# EAGLE design stm32f4 (EAGLE 5.11)
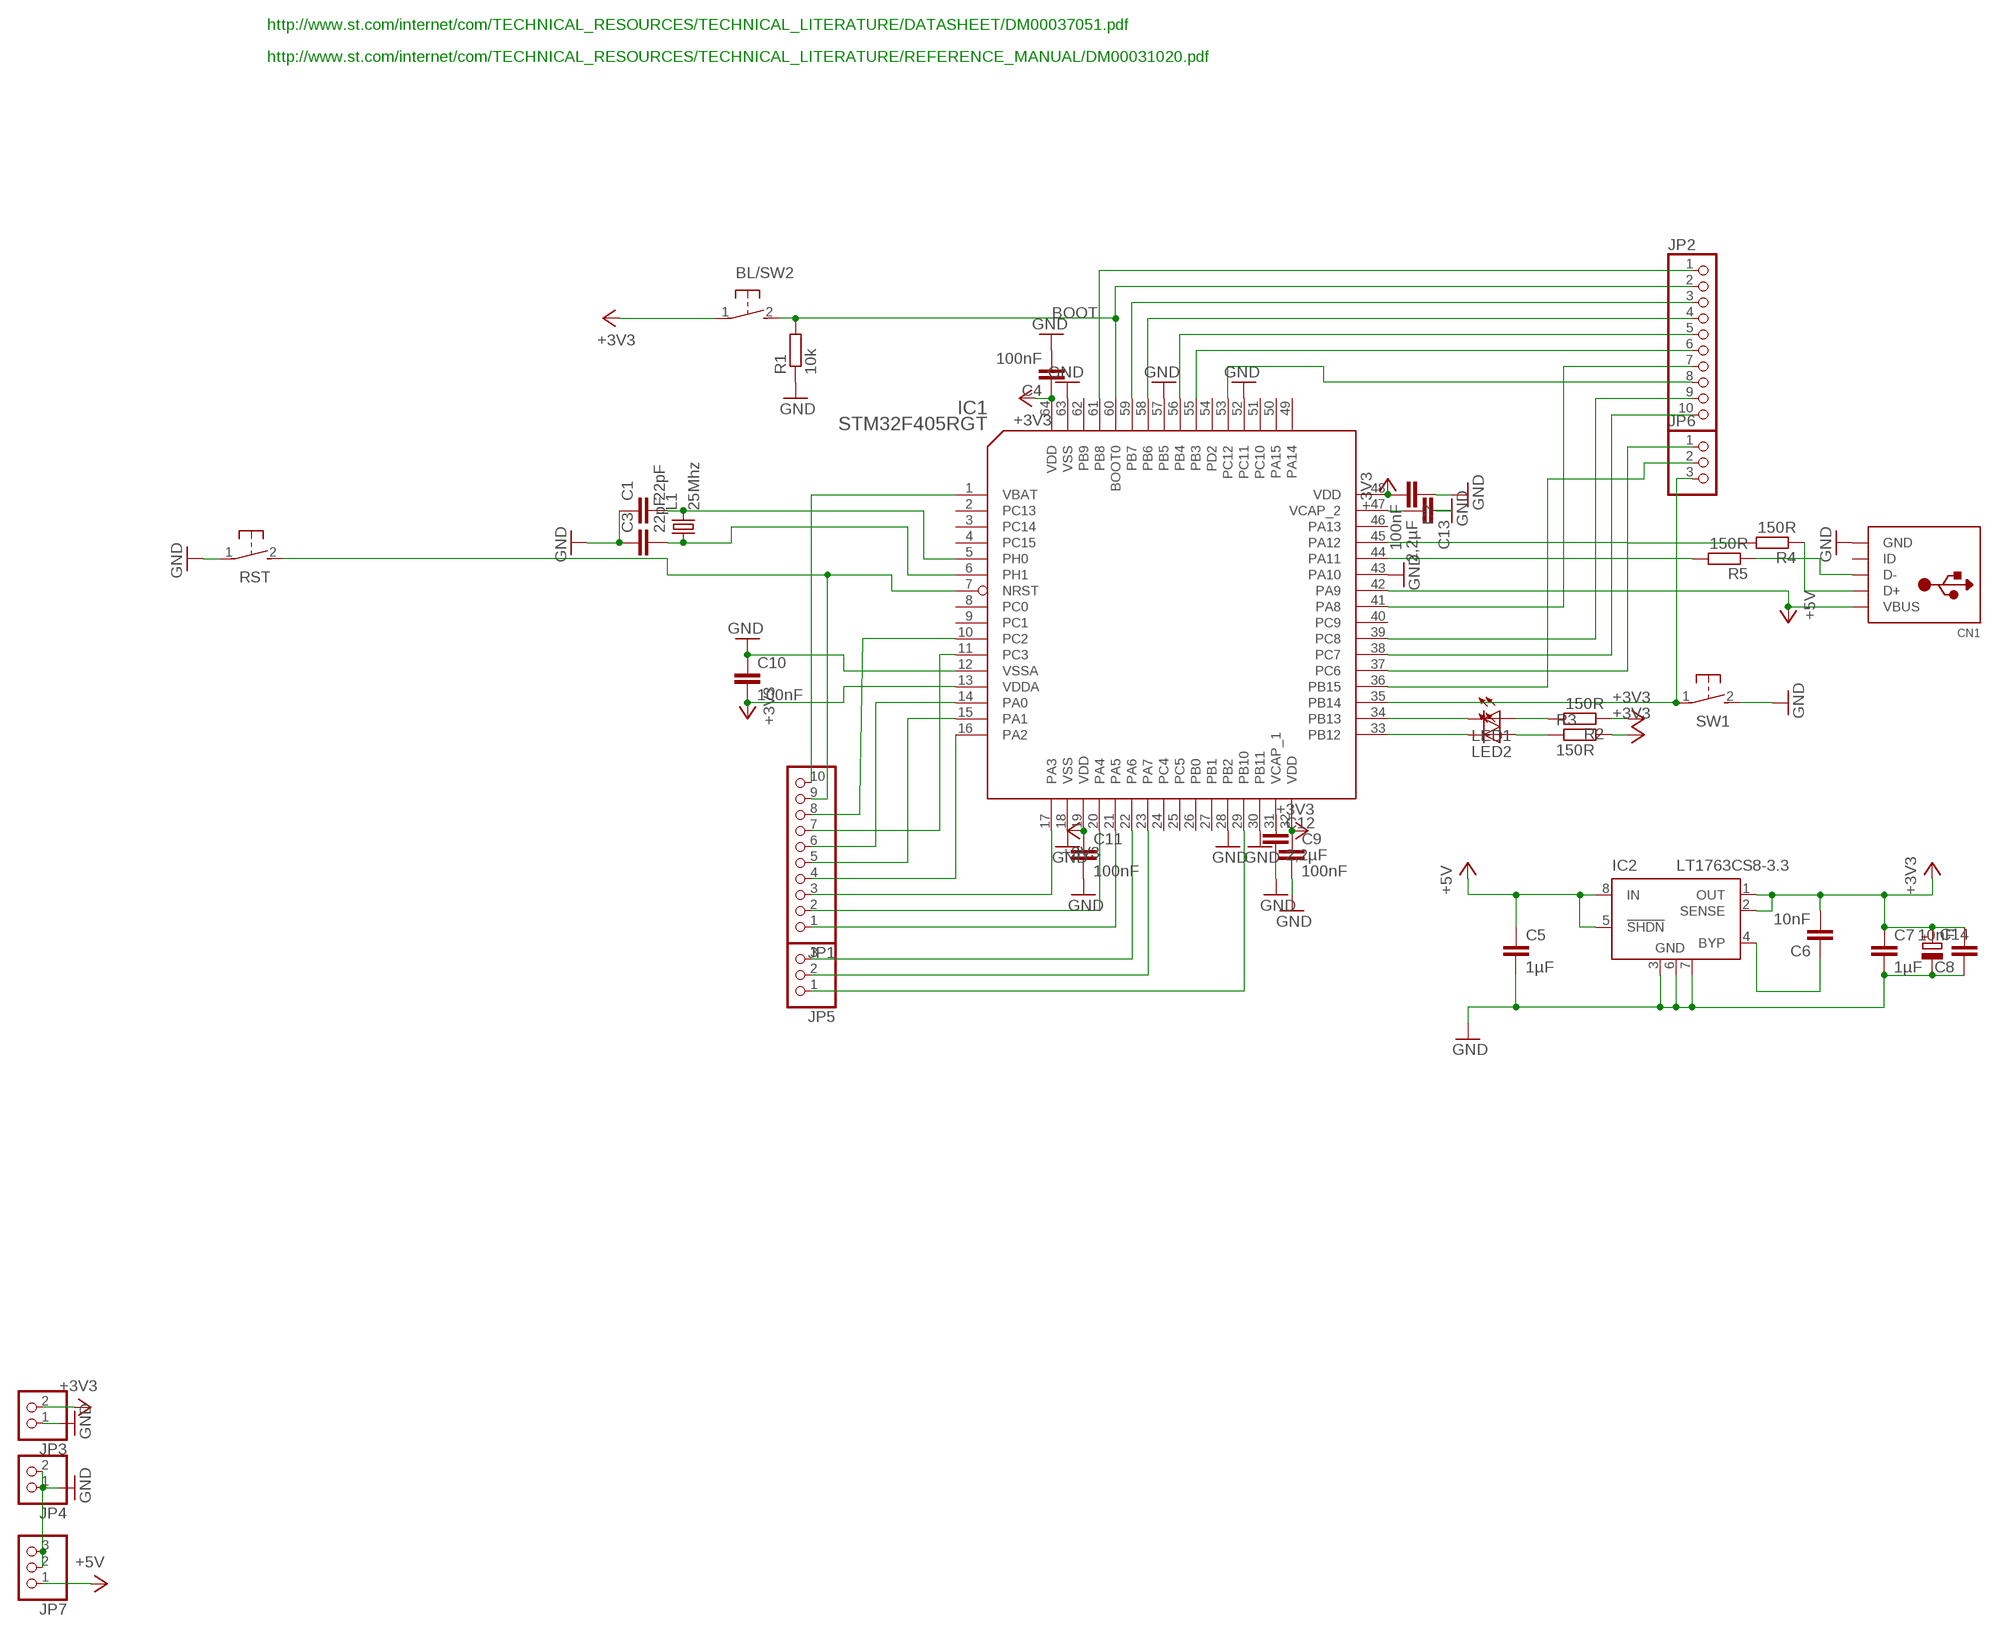
[diagram p0: schematic, sheet 1]

## Parts
BL/SW2  SWITCH_MCTAEF  [SWITCH_MCTAEF]
C1  22pF  C-EUC0402  [C0402]
C2  100nF  C-EUC0402  [C0402]
C3  22pF  C-EUC0402  [C0402]
C4  100nF  C-EUC0402  [C0402]
C5  1µF  CAP0805  [0805]
C6  10nF  C-EUC0402  [C0402]
C7  1µF  CAP0805  [0805]
C8  10nF  C-EUC0402  [C0402]
C9  100nF  C-EUC0402  [C0402]
C10  100nF  C-EUC0402  [C0402]
C11  100nF  C-EUC0402  [C0402]
C12  2,2µF  CAP0805  [0805]
C13  2,2µF  CAP0805  [0805]
C14  CPOL-EUSMCA  [SMC_A]
CN1  USBMINIB  [USB-MINIB]
IC1  STM32F405RGT  [LQFP64]
IC2  LT1763CS8-3.3  [SOIC8]
JP1  PINHD-1X10_2.54  [1X10]
JP2  PINHD-1X10_2.54  [1X10]
JP3  PINHD-1X02_2.54  [1X02]
JP4  PINHD-1X02_2.54  [1X02]
JP5  PINHD-1X03_2.54  [1X03]
JP6  PINHD-1X03_2.54  [1X03]
JP7  PINHD-1X03_2.54  [1X03]
L1  25Mhz  X22-OSCILLATOR  [X22]
LED1  LEDCHIPLED_0805  [CHIPLED_0805]
LED2  LEDCHIPLED_0805  [CHIPLED_0805]
R1  10k  R-EU_R0402  [R0402]
R2  150R  R-EU_R0402  [R0402]
R3  150R  R-EU_R0402  [R0402]
R4  150R  R-EU_R0402  [R0402]
R5  150R  R-EU_R0402  [R0402]
RST  SWITCH_MCTAEF  [SWITCH_MCTAEF]
SW1  SWITCH_MCTAEF  [SWITCH_MCTAEF]

## Nets
+3V3: BL/SW2.1 C2.2 C4.1 C6.2 C7.1 C8.2 C9.1 C10.2 C11.1 C14.+ IC1.13(VDDA) IC1.19(VDD) IC1.32(VDD) IC1.48(VDD) IC1.64(VDD) IC2.1(OUT) IC2.2(SENSE) JP3.2 R2.1 R3.2
+5V: C5.1 CN1.VBUS IC1.42(PA9) IC2.5(!SHDN) IC2.8(IN) JP7.1
A0: IC1.14(PA0) JP1.6
A1: IC1.15(PA1) JP1.5
A3: IC1.17(PA3) JP1.3
A4: IC1.20(PA4) JP1.2
A5: IC1.21(PA5) JP1.1
A6: IC1.22(PA6) JP5.3
A7: IC1.23(PA7) JP5.2
A8: IC1.41(PA8) JP2.7
B4: IC1.56(PB4) JP2.5
B6: IC1.58(PB6) JP2.4
B7: IC1.59(PB7) JP2.3
B8: IC1.61(PB8) JP2.1
B10: IC1.29(PB10) JP5.1
B14: IC1.35(PB14) JP6.3 SW1.1
B15: IC1.36(PB15) JP6.2
BOOT: BL/SW2.2 IC1.60(BOOT0) JP2.2 R1.2
C2: IC1.10(PC2) JP1.8
C3: IC1.11(PC3) JP1.7
C6: IC1.37(PC6) JP6.1
C7: IC1.38(PC7) JP2.10
C8: IC1.39(PC8) JP2.9
C12: IC1.53(PC12) JP2.8
GND: C1.1 C2.1 C3.1 C4.2 C5.2 C7.2 C8.1 C9.2 C10.1 C11.2 C12.2 C13.1 C14.- CN1.GND IC1.12(VSSA) IC1.18(VSS) IC1.28(PB2) IC1.30(PB11) IC1.43(PA10) IC1.52(PC11) IC1.57(PB5) IC1.63(VSS) IC2.3(GND) IC2.6(GND) IC2.7(GND) JP3.1 JP4.1 JP4.2 JP7.2 JP7.3 R1.1 RST.1 SW1.2
N$2: IC1.16(PA2) JP1.4
N$3: C3.2 IC1.6(PH1) L1.1
N$4: C1.2 IC1.5(PH0) L1.3
N$5: IC1.7(NRST) JP1.9 RST.2
N$10: IC1.44(PA11) R5.2
N$12: C12.1 IC1.31(VCAP_1)
N$13: C6.1 IC2.4(BYP)
N$14: C13.2 IC1.47(VCAP_2)
N$15: IC1.33(PB12) LED2.C
N$18: LED1.A R2.2
N$22: LED2.A R3.1
N$26: IC1.34(PB13) LED1.C
N$32: IC1.45(PA12) R4.2
N$39: CN1.D+ R4.1
N$40: CN1.D- R5.1
PB3: IC1.55(PB3) JP2.6
VBAT: IC1.1(VBAT) JP1.10
Unconnected: CN1.ID IC1.2(PC13) IC1.3(PC14) IC1.4(PC15) IC1.8(PC0) IC1.9(PC1) IC1.24(PC4) IC1.25(PC5) IC1.26(PB0) IC1.27(PB1) IC1.40(PC9) IC1.46(PA13) IC1.49(PA14) IC1.50(PA15) IC1.51(PC10) IC1.54(PD2) IC1.62(PB9)

## Notes on the sheet
- http://www.st.com/internet/com/TECHNICAL_RESOURCES/TECHNICAL_LITERATURE/DATASHEET/DM00037051.pdf
- http://www.st.com/internet/com/TECHNICAL_RESOURCES/TECHNICAL_LITERATURE/REFERENCE_MANUAL/DM00031020.pdf

## Library data of the parts
BL/SW2 RST SW1 = seb:SWITCH_MCTAEF
C1-C4 C6 C8-C11 = rcl:C-EU: CAPACITOR, European symbol
C5 C7 C12 C13 = SparkFun:CAP: Capacitor Standard 0603 ceramic capacitor, and 0.1" leaded capacitor.
C14 = rcl:CPOL-EU: POLARIZED CAPACITOR, European symbol
CN1 = microbuilder:USB: USB Connectors USBMINIB - Surface Mount Female Mini-B USB Connector 4UConnector: 06564
IC1 = stm32:STM32F405R*T: STM32F405R*T ARM Cortex-M4 32b MCU+FPU, 210DMIPS, up to 1MB Flash/192+4KB RAM, USB OTG HS/FS, 17 TIMs, 3 ADCs, 15 comm.
IC2 = linear-technology:LT1763CS8: 500mA, Low Noise, LDO Micropower Regulators Source: http://cds.linear.com/docs/Datasheet/1763ff.pdf; MPN: LT1763CS8-3.3; OC_FARNELL: 1273617; OC_NEWARK: 57M6055
JP1 JP2 = pinhead-2:PINHD-1X10: PIN HEADER
JP3 JP4 = pinhead-2:PINHD-1X02: PIN HEADER
JP5-JP7 = pinhead-2:PINHD-1X03: PIN HEADER
L1 = seb:X22-OSCILLATOR
LED1 LED2 = led:LED: LED OSRAM: - CHIPLED LG R971, LG N971, LY N971, LG Q971, LY Q971, LO R971, LY R971 LH N974, LH R974 LS Q976, LO Q976, LY Q976 LO Q996 - Hyper CHIPLED LW Q18S LB Q993, LB Q99A, LB R99A - SideLED LS A670, LO A670, LY A670, LG A670, LP A670 LB A673, LV A673, LT A673, LW A673 LH A674 LY A675 LS A676, LA A676, LO A676, LY A676, LW A676 LS A679, LY A679, LG A679 - Hyper Micro SIDELED® LS Y876, LA Y876, LO Y876, LY Y876 LT Y87S - SmartLED LW L88C, LW L88S LB L89C, LB L89S, LG L890 LS L89K, LO L89K, LY L89K LS L896, LA L896, LO L896, LY L896 - TOPLED LS T670, LO T670, LY T670, LG T670, LP T670 LSG T670, LSP T670, LSY T670, LOP T670, LYG T670 LG T671, LOG T671, LSG T671 LB T673, LV T673, LT T673, LW T673 LH T674 LS T676, LA T676, LO T676, LY T676, LB T676, LH T676, LSB T676, LW T676 LB T67C, LV T67C, LT T67C, LS T67K, LO T67K, LY T67K, LW E67C LS E67B, LA E67B, LO E67B, LY E67B, LB E67C, LV E67C, LT E67C LW T67C LS T679, LY T679, LG T679 LS T770, LO T770, LY T770, LG T770, LP T770 LB T773, LV T773, LT T773, LW T773 LH T774 LS E675, LA E675, LY E675, LS T675 LS T776, LA T776, LO T776, LY T776, LB T776 LHGB T686 LT T68C, LB T68C - Hyper Mini TOPLED® LB M676 - Mini TOPLED Santana® LG M470 LS M47K, LO M47K, LY M47K Source: http://www.osram.convergy.de LUXEON: - LUMILED® LXK2-PW12-R00, LXK2-PW12-S00, LXK2-PW14-U00, LXK2-PW14-V00 LXK2-PM12-R00, LXK2-PM12-S00, LXK2-PM14-U00 LXK2-PE12-Q00, LXK2-PE12-R00, LXK2-PE12-S00, LXK2-PE14-T00, LXK2-PE14-U00 LXK2-PB12-K00, LXK2-PB12-L00, LXK2-PB12-M00, LXK2-PB14-N00, LXK2-PB14-P00, LXK2-PB14-Q00 LXK2-PR12-L00, LXK2-PR12-M00, LXK2-PR14-Q00, LXK2-PR14-R00 LXK2-PD12-Q00, LXK2-PD12-R00, LXK2-PD12-S00 LXK2-PH12-R00, LXK2-PH12-S00 LXK2-PL12-P00, LXK2-PL12-Q00, LXK2-PL12-R00 Source: www.luxeon.com KINGBRIGHT: KA-3528ASYC Source: www.kingbright.com
R1-R5 = rcl:R-EU_: RESISTOR, European symbol

## Board
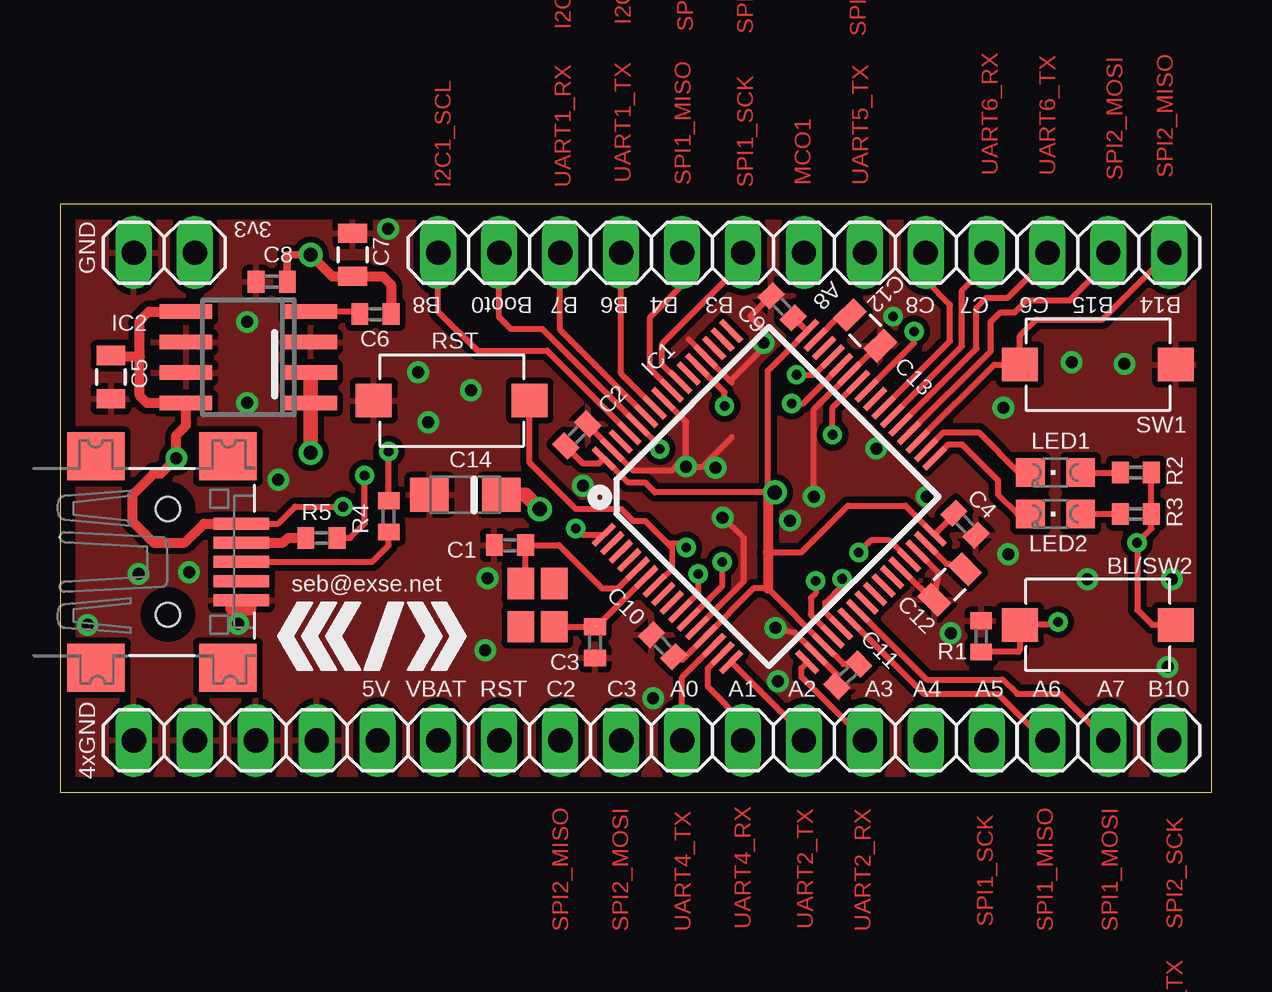
[diagram p1: board, top side]
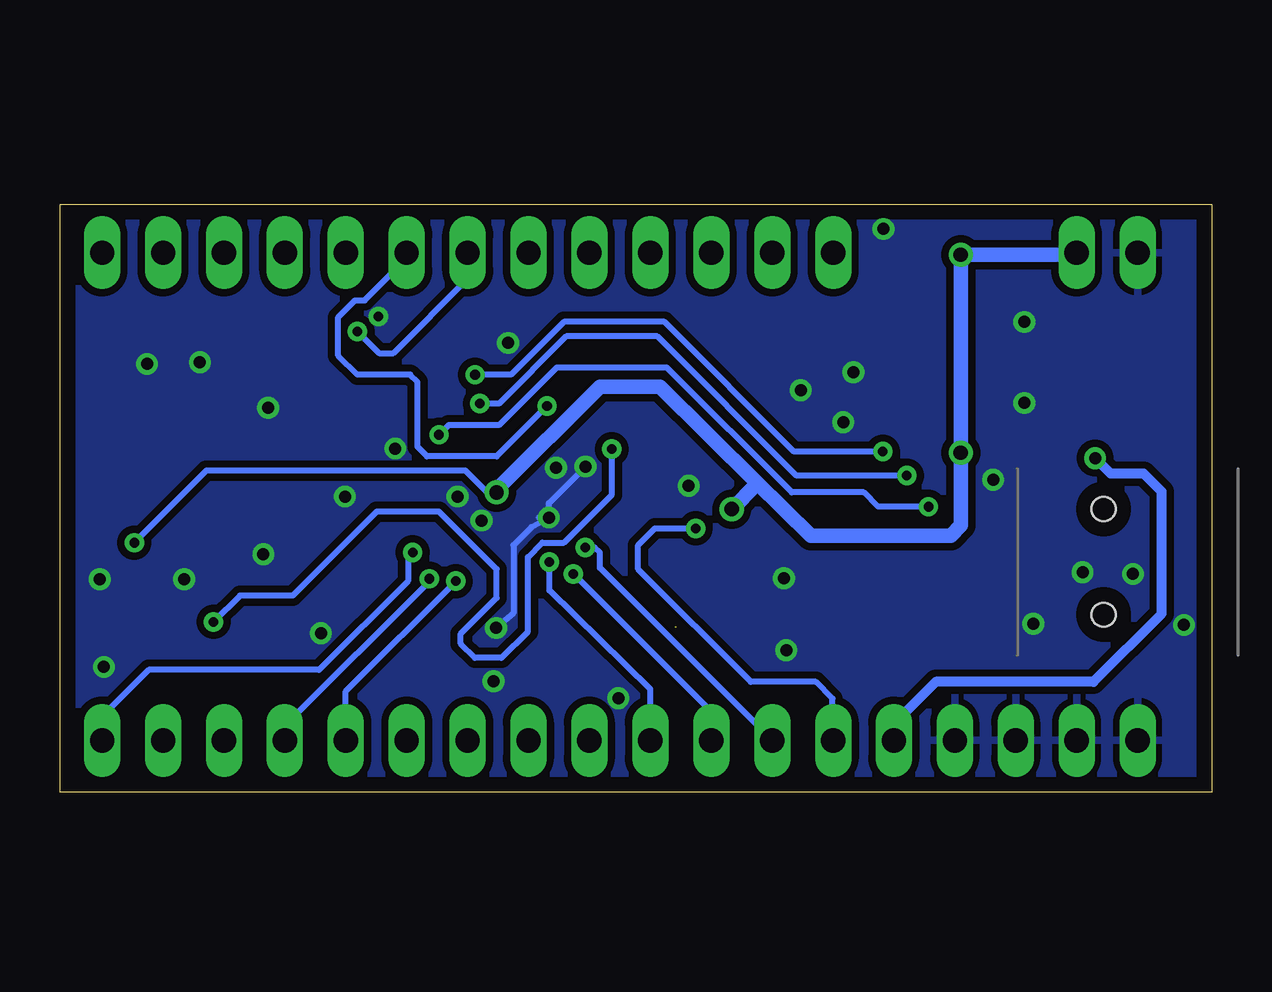
[diagram p2: board, bottom side, seen from below]

Size 48 x 24.5 mm. Coordinates in mm from the lower left corner, seen from the top.
Outline: 0,0 48,0 48,24.5 0,24.5 0,0
Copper layers (1*16): Top 0.035mm / dielectric 1.5mm / Bottom 0.035mm
Design rules "default *": minimum track width 9mil, minimum drill 0.4mm, track to track 8mil, track to pad 8mil, pad to pad 8mil, via to via 8mil, smd to smd 8mil, copper to edge 25mil, drill to drill 8mil, minimum pad ring 10mil, minimum via ring 8mil, stop-mask expansion 4mil, vias tented up to drill 40mil, thermal gap 10mil

### Footprints (pad centres in the part's own frame; a part is rotated, then mirrored left to right if it is on the bottom)
SWITCH_MCTAEF = smd 1.5 x 1.4: 1 -3.25,0; 2 3.25,0
C0402 = smd 0.7 x 0.9: 1 -0.65,0; 2 0.65,0
0805 = smd 0.8 x 1.2: 1 -0.9,0; 2 0.9,0
SMC_A = smd 1.6 x 1.4: + -1.5,0; - 1.5,0
USB-MINIB = smd 0.5 x 2.308: D+ 0,4.064; D- -0.8,4.064; GND 1.6,4.064; ID 0.8,4.064; VBUS -1.6,4.064 | smd 2 x 2.4: GND1 -4.4,-2; GND2 -4.4,3.5; GND3 4.4,3.5; GND4 4.4,-2 | hole 1: -2.2,1; 2.2,1
LQFP64 = smd 0.24 x 1.2: 1 -3.75,-6; 2 -3.25,-6; 3 -2.75,-6; 4 -2.25,-6; 5 -1.75,-6; 6 -1.25,-6; 7 -0.75,-6; 8 -0.25,-6; 9 0.25,-6; 10 0.75,-6; 11 1.25,-6; 12 1.75,-6; 13 2.25,-6; 14 2.75,-6; 15 3.25,-6; 16 3.75,-6; 33 3.75,6; 34 3.25,6; 35 2.75,6; 36 2.25,6; 37 1.75,6; 38 1.25,6; 39 0.75,6; 40 0.25,6; 41 -0.25,6; 42 -0.75,6; 43 -1.25,6; 44 -1.75,6; 45 -2.25,6; 46 -2.75,6; 47 -3.25,6; 48 -3.75,6 | smd 1.2 x 0.24: 17 6,-3.75; 18 6,-3.25; 19 6,-2.75; 20 6,-2.25; 21 6,-1.75; 22 6,-1.25; 23 6,-0.75; 24 6,-0.25; 25 6,0.25; 26 6,0.75; 27 6,1.25; 28 6,1.75; 29 6,2.25; 30 6,2.75; 31 6,3.25; 32 6,3.75; 49 -6,3.75; 50 -6,3.25; 51 -6,2.75; 52 -6,2.25; 53 -6,1.75; 54 -6,1.25; 55 -6,0.75; 56 -6,0.25; 57 -6,-0.25; 58 -6,-0.75; 59 -6,-1.25; 60 -6,-1.75; 61 -6,-2.25; 62 -6,-2.75; 63 -6,-3.25; 64 -6,-3.75
SOIC8 = smd 0.6 x 2.2: 1 -1.905,-2.6; 2 -0.635,-2.6; 3 0.635,-2.6; 4 1.905,-2.6; 5 1.905,2.6; 6 0.635,2.6; 7 -0.635,2.6; 8 -1.905,2.6
1X10 = drill 1.016 long: 1 -11.43,0; 2 -8.89,0; 3 -6.35,0; 4 -3.81,0; 5 -1.27,0; 6 1.27,0; 7 3.81,0; 8 6.35,0; 9 8.89,0; 10 11.43,0
1X02 = drill 1.016 long: 1 -1.27,0; 2 1.27,0
1X03 = drill 1.016 long: 1 -2.54,0; 2 0,0; 3 2.54,0
X22 = smd 1.3 x 1.1: 1 0.9,0.7; 2 -0.9,0.7; 3 -0.9,-0.7; 4 0.9,-0.7
CHIPLED_0805 = smd 1.2 x 1.2: A 0,-1.05; C 0,1.05
R0402 = smd 0.7 x 0.9: 1 -0.65,0; 2 0.65,0

### Placement (x,y rotation side)
BL/SW2  43.27,6.97 180 top
C1  18.75,10.3 0 top
C2  21.54,14.89 225 top
C3  22.3,6.25 90 top
C4  37.73,11.17 315 top
C5  2.12,17.3 270 top
C6  13.15,19.93 0 top
C7  12.2,22.4 90 top
C8  8.82,21.27 0 top
C9  30.1,20.23 135 top
C10  25.12,6.11 315 top
C11  32.84,4.89 225 top
C12  37.09,8.66 225 top
C13  33.56,19.25 135 top
C14  16.9,12.4 180 top
CN1  3.5,9.6 270 top
IC1  29.56,12.32 315 top
IC2  7.85,18.12 90 top
JP1  27.2,2.17 180 top
JP2  27.2,22.48 0 top
JP3  4.35,22.48 0 top
JP4  4.35,2.17 0 top
JP5  43.7,2.17 180 top
JP6  43.7,22.48 0 top
JP7  10.7,2.17 180 top
L1  19.9,7.8 270 top
LED1  41.49,13.32 90 top
LED2  41.49,11.6 90 top
R1  38.4,6.5 270 top
R2  44.84,13.32 180 top
R3  44.84,11.6 0 top
R4  13.7,11.5 90 top
R5  10.9,10.6 0 top
RST  16.32,16.32 0 top
SW1  43.27,17.82 0 top

### Tracks (layer width: path | path; a pad name or v marks a point on that pad's centre or on a via)
+3V3  (via drill 0.4, 0.6)
  Top 0.254: R2.1 R3.2 45.49,10.99 v44.9,10.4 44.9,7.6 45.52,6.97 BL/SW2.1 | C9.1 30.6,19.77 IC1.48 29.5,17.57 29.5,12.5 | C4.1 37.17,11.44 IC1.32 35.24,11.95 32.85,11.95 30.9,10 29.5,10 | C11.1 32.65,5.35 IC1.19 29.5,8.5 28.92,8.5 IC1.13 25.94,5.52 C10.2 | C2.2 21.81,13.7 22.45,13.7 IC1.64 23.68,12.9 24.4,12.9 24.8,12.5 v29.8,12.5
  Top 0.305: C8.2 9.47,22.4 v10.45,22.4 | v29.8,12.5 29.5,12.5
  Top 0.406: C6.2 13.8,21.15 13.45,21.5 C7.1 11.35,21.5 v10.45,22.4 | 29.5,12.5 29.5,10 29.5,8.5
  Top 0.61: v10.45,14.15 IC2.1 IC2.2 | v10.45,22.4 10.47,22.43 | C14.+ 19.4,12.4 v20,11.8
  Bottom 0.254: v29.8,12.5 30.2,12.5 31.1,13.4 41.9,13.4 v44.9,10.4
  Bottom 0.61: JP3.2 5.3,22.4 v10.45,22.4 v10.45,14.15 10.45,11.12 10.88,10.7 16.7,10.7 18.96,12.93 | v29.8,12.5 29.8,12.6 25.5,16.9 23,16.9 18.96,12.93 | v20,11.8 18.96,12.84 18.96,12.93
+5V  (via drill 0.4, 0.5)
  Top 0.254: IC1.42 32.2,16.02 v32.2,14.9 | v11.8,11.9 9.8,11.9 9.1,11.2 CN1.VBUS
  Top 0.406: IC2.5 3.71,20.03 3.33,19.65 3.33,18.15 | 3.33,18.15 3.33,16.52 3.63,16.22 IC2.8 5.25,15.29 4.85,14.88 v4.85,13.93 4.2,13.28 3.9,13.28 3,12.38 3,11.3 3.9,10.4 5.2,10.4 6,11.2 CN1.VBUS | C5.1 2.1,18.15 3.33,18.15
  Bottom 0.254: v32.2,14.9 31.8,15.3 29.7,15.3 27.3,17.7 22.7,17.7 17.5,12.5 14.5,12.5 13.9,11.9 v11.8,11.9
  Bottom 0.406: v4.85,13.93 4.2,13.28 2.83,13.28 2.08,12.53 2.08,7.45 4.92,4.6 11.5,4.6 13.24,2.86 JP7.1
A0
  Top 0.254: IC1.14 25.93,4.8 JP1.6
A1
  Top 0.254: IC1.15 27,5.17 27,4.4 28.47,2.93 JP1.5
A3
  Top 0.254: JP1.3 30.9,4.82 30.9,5.18 IC1.17
A4  (via drill 0.4)
  Top 0.254: IC1.20 31.3,7.41 31.3,8.1 31.5,8.3 v31.5,8.8
  Bottom 0.254: JP1.2 36.09,4.21 v31.5,8.8
A5  (via drill 0.4)
  Top 0.254: IC1.21 31.9,7.51 31.9,7.9 32.6,8.6 v32.6,8.9
  Bottom 0.254: JP1.1 38.63,2.77 32.6,8.8 v32.6,8.9
A6
  Top 0.254: IC1.22 36.02,4.1 39.1,4.1 41.03,2.17 JP5.3
A7
  Top 0.254: IC1.23 36.13,4.7 39.3,4.7 39.9,4.1 41.7,4.1 43.63,2.17 JP5.2
A8  (via drill 0.4)
  Top 0.254: IC1.41 35.6,18.72 v35.6,19.2
  Bottom 0.254: JP2.7 31.01,21.39 34.1,18.3 34.7,18.3 v35.6,19.2
B4
  Top 0.254: IC1.56 24.6,17.64 24.6,19.8 25.93,21.13 JP2.5
B6
  Top 0.254: IC1.58 23.39,17.44 JP2.4
B7
  Top 0.254: IC1.59 20.85,19.27 JP2.3
B8
  Top 0.254: IC1.61 20.3,18.4 17.4,18.4 15.77,20.03 JP2.1
B10  (via drill 0.4)
  Top 0.254: IC1.29 34.57,10.5 33.8,10.5 v33.3,10
  Bottom 0.254: JP5.1 46.24,3.16 44.3,5.1 37.2,5.1 33.5,8.8 33.5,9.8 v33.3,10
B14
  Top 0.254: IC1.35 38.95,17.82 SW1.1 40.02,19.02 40.7,19.7 43.45,19.7 JP6.3
B15
  Top 0.254: IC1.36 38.8,18.38 38.8,19.6 39.2,20 39.8,20 40.3,20.5 42.1,20.5 43.7,22.1 JP6.2
BOOT  (via drill 0.4)
  Top 0.254: v25,14.3 25,14.41 IC1.60 20.11,19.3 18.8,19.3 18.31,19.79 JP2.2 | BL/SW2.2 39.45,7.1 | R1.2 39.95,5.85 40,5.9 40,6.96 BL/SW2.2 | BL/SW2.2 41.48,6.97 v41.6,7.1
  Bottom 0.254: v25,14.3 25,12.4 27,10.4 27.9,10.4 28.5,9.8 28.5,6.7 29.6,5.6 30.7,5.6 31.3,6.2 31.3,6.6 29.8,8.1 29.8,9.3 32.2,11.7 34.8,11.7 38.3,8.2 40.5,8.2 v41.6,7.1
C2  (via drill 0.4)
  Top 0.254: IC1.10 26.6,8.3 v26.6,9.1
  Bottom 0.254: v26.6,9.1 20.85,3.35 JP1.8
C3  (via drill 0.4)
  Top 0.254: IC1.11 27.6,8.6 v27.6,9.6
  Bottom 0.254: JP1.7 23.39,4.3 27.6,8.41 v27.6,9.6
C6
  Top 0.254: IC1.37 38.2,18.49 38.2,20.2 38.6,20.6 39.5,20.6 41.16,22.26 JP6.1
C7
  Top 0.254: IC1.38 37.6,18.6 37.6,20.9 38.63,21.93 JP2.10
C8
  Top 0.254: IC1.39 37.1,18.8 37.1,20.3 36.09,21.31 JP2.9
C12  (via drill 0.4)
  Top 0.254: IC1.53 27.7,16.66 v27.7,16.1
  Bottom 0.254: JP2.8 33.55,22.25 35.3,20.5 35.7,20.5 36.4,19.8 36.4,18.2 35.6,17.4 33.4,17.4 33.1,17.1 33.1,14.4 32.7,14 29.8,14 v27.7,16.1
GND  (via drill 0.4, 0.5)
  Top 0.254: C11.2 32.38,4.91 IC1.18 30.64,6.65 v29.82,6.85 | C2.1 22,15.29 IC1.63 23.89,13.4 25.5,13.4 25.68,13.57 v26.09,13.57 | IC1.12 28.5,8.79 28.5,10.6 27.62,11.48 v27.62,11.45 | IC1.57 26.09,15.44 v26.09,13.57 | 27.88,17.18 28,17.07 | 27.88,17.18 IC1.52 26.21,18.86 | 28,14.8 26.77,13.57 v26.09,13.57 | C9.2 28.8,19.85 28.8,19.8 29.4,19.2 29.4,18.6 27.98,17.18 27.88,17.18 | IC1.28 35.76,8.6 C12.2 36.63,9.15 IC1.30 | C13.1 33.62,18.16 IC1.43 31.43,15.96 v31.43,12.32 | CN1.GND 7.6,7.96 7.6,7.67
  Top 0.61: 7.88,7.67 7.6,7.67 7.2,7.67
  Top 0.813: JP4.1 2.85,2.33
  Bottom 0.254: v29.82,6.85 29.1,7.47 29.1,10.3 28.35,11.05 v27.62,11.45 | v26.09,13.57 27.62,12.05 v27.62,11.45 | v27.62,11.45 28.05,11.45
  other vias: 46.34,8.88 46.17,5.22 44.37,17.85 42.17,17.93 3.27,9.1 5.38,9.18 7.8,16.23 7.8,19.6 14.93,17.5 17.82,8.93 15.35,15.43 17.12,16.75 1.15,6.97 13.68,23.48 9.1,13.03 42.82,8.88 27.32,13.53 30.43,11.32 34.02,14.32 36.12,12.32 39.52,9.93 39.33,16.02 34.73,19.82 29.93,4.62 24.73,3.92 17.73,5.92 7.42,7.03 29.32,18.73 21.8,12.78 37.12,6.62
  pour Top (isolate 0.254): 0.05,0 48.07,-0.03 48.07,24.73 -0.05,24.65
  pour Bottom (isolate 0.305): 0.03,0 48.07,-0.03 48.07,24.73 -0.07,24.65
N$2
  Top 0.254: IC1.16 31.01,2.39 JP1.4
N$3  (1 unrouted)
  Top 0.254: IC1.6 22.37,6.9 L1.1
N$4
  Top 0.254: IC1.5 23.26,8.5 22.6,8.5 20.8,10.3 C1.2 19.4,8.9 L1.3
N$5  (via drill 0.4)
  Top 0.254: IC1.7 25.5,9.32 25.5,10.2 25.35,10.35 | RST.2 19.57,13.72 21.5,11.8 23.4,11.8 23.9,11.3 24.4,11.3 25.35,10.35 | v26.1,10.2 25.95,10.35 25.35,10.35
  Bottom 0.254: JP1.9 25.5,9.36 25.5,10 25.7,10.2 v26.1,10.2
N$10  (via drill 0.4)
  Top 0.254: IC1.44 30.96,16.2 v30.5,16.2 | v12.7,13.2 12.7,11.2 12.1,10.6 R5.2
  Bottom 0.254: v30.5,16.2 29.7,16.2 26.9,19 23.1,19 17.3,13.2 v12.7,13.2
N$12
  Top 0.254: IC1.31 36.97,9.52 C12.1
N$13
  Top 0.254: IC2.4 12.48,20.03 C6.1
N$14
  Top 0.254: IC1.47 32.55,19.91 C13.2
N$15
  Top 0.254: IC1.33 37.04,14.5 37.6,14.5 39.1,13 39.1,12.4 39.9,11.6 LED2.C
N$18
  Top 0.254: LED1.A R2.2
N$22
  Top 0.254: LED2.A R3.1 44.27,11.47
N$26
  Top 0.254: IC1.34 36.83,15 38.3,15 39.98,13.32 LED1.C
N$32  (via drill 0.4)
  Top 0.254: IC1.45 31.45,17.4 v30.7,17.4 | R4.2 v13.7,14.2
  Bottom 0.254: v30.7,17.4 29.2,17.4 27,19.6 22.8,19.6 17.4,14.2 v13.7,14.2
N$39
  Top 0.254: CN1.D+ 13,9.6 13.7,10.3 R4.1
N$40
  Top 0.406: CN1.D- 9.3,10.4 9.5,10.6 R5.1
PB3
  Top 0.254: JP2.6 28.47,22.07 25.1,18.7 25.1,17.85 IC1.55
VBAT  (via drill 0.4)
  Top 0.254: v21.5,11 21.77,10.73 IC1.1
  Bottom 0.254: JP1.10 15.8,2.19 15.8,3.9 16.5,4.6 19.2,4.6 23.9,9.3 23.9,10.3 23.2,11 v21.5,11

### Text on the board
Top: I2C1_SDA | I2C1_SCL | SPI3_MISO | SPI3_SCK | SPI3_MOSI | UART6_RX | UART6_TX | SPI2_MOSI | SPI2_MISO | I2C1_SCL | UART1_RX | UART1_TX | SPI1_MISO | SPI1_SCK | MCO1 | UART5_TX | SPI2_MISO | SPI2_MOSI | UART4_TX | UART4_RX | UART2_TX | UART2_RX | SPI1_SCK | SPI1_MISO | SPI1_MOSI | SPI2_SCK | UART3_TX
tNames: 3v3 | GND | C12 | B8 | Boot0 | B7 | B6 | B4 | B3 | A8 | C8 | C7 | C6 | B15 | B14 | seb@exse.net | 5V | VBAT | RST | C2 | C3 | A0 | A1 | A2 | A3 | A4 | A5 | A6 | A7 | B10 | 4xGND
bStop: seb@exse.net